# EAGLE schematic bc-module-encoder (EAGLE 7.7.0)
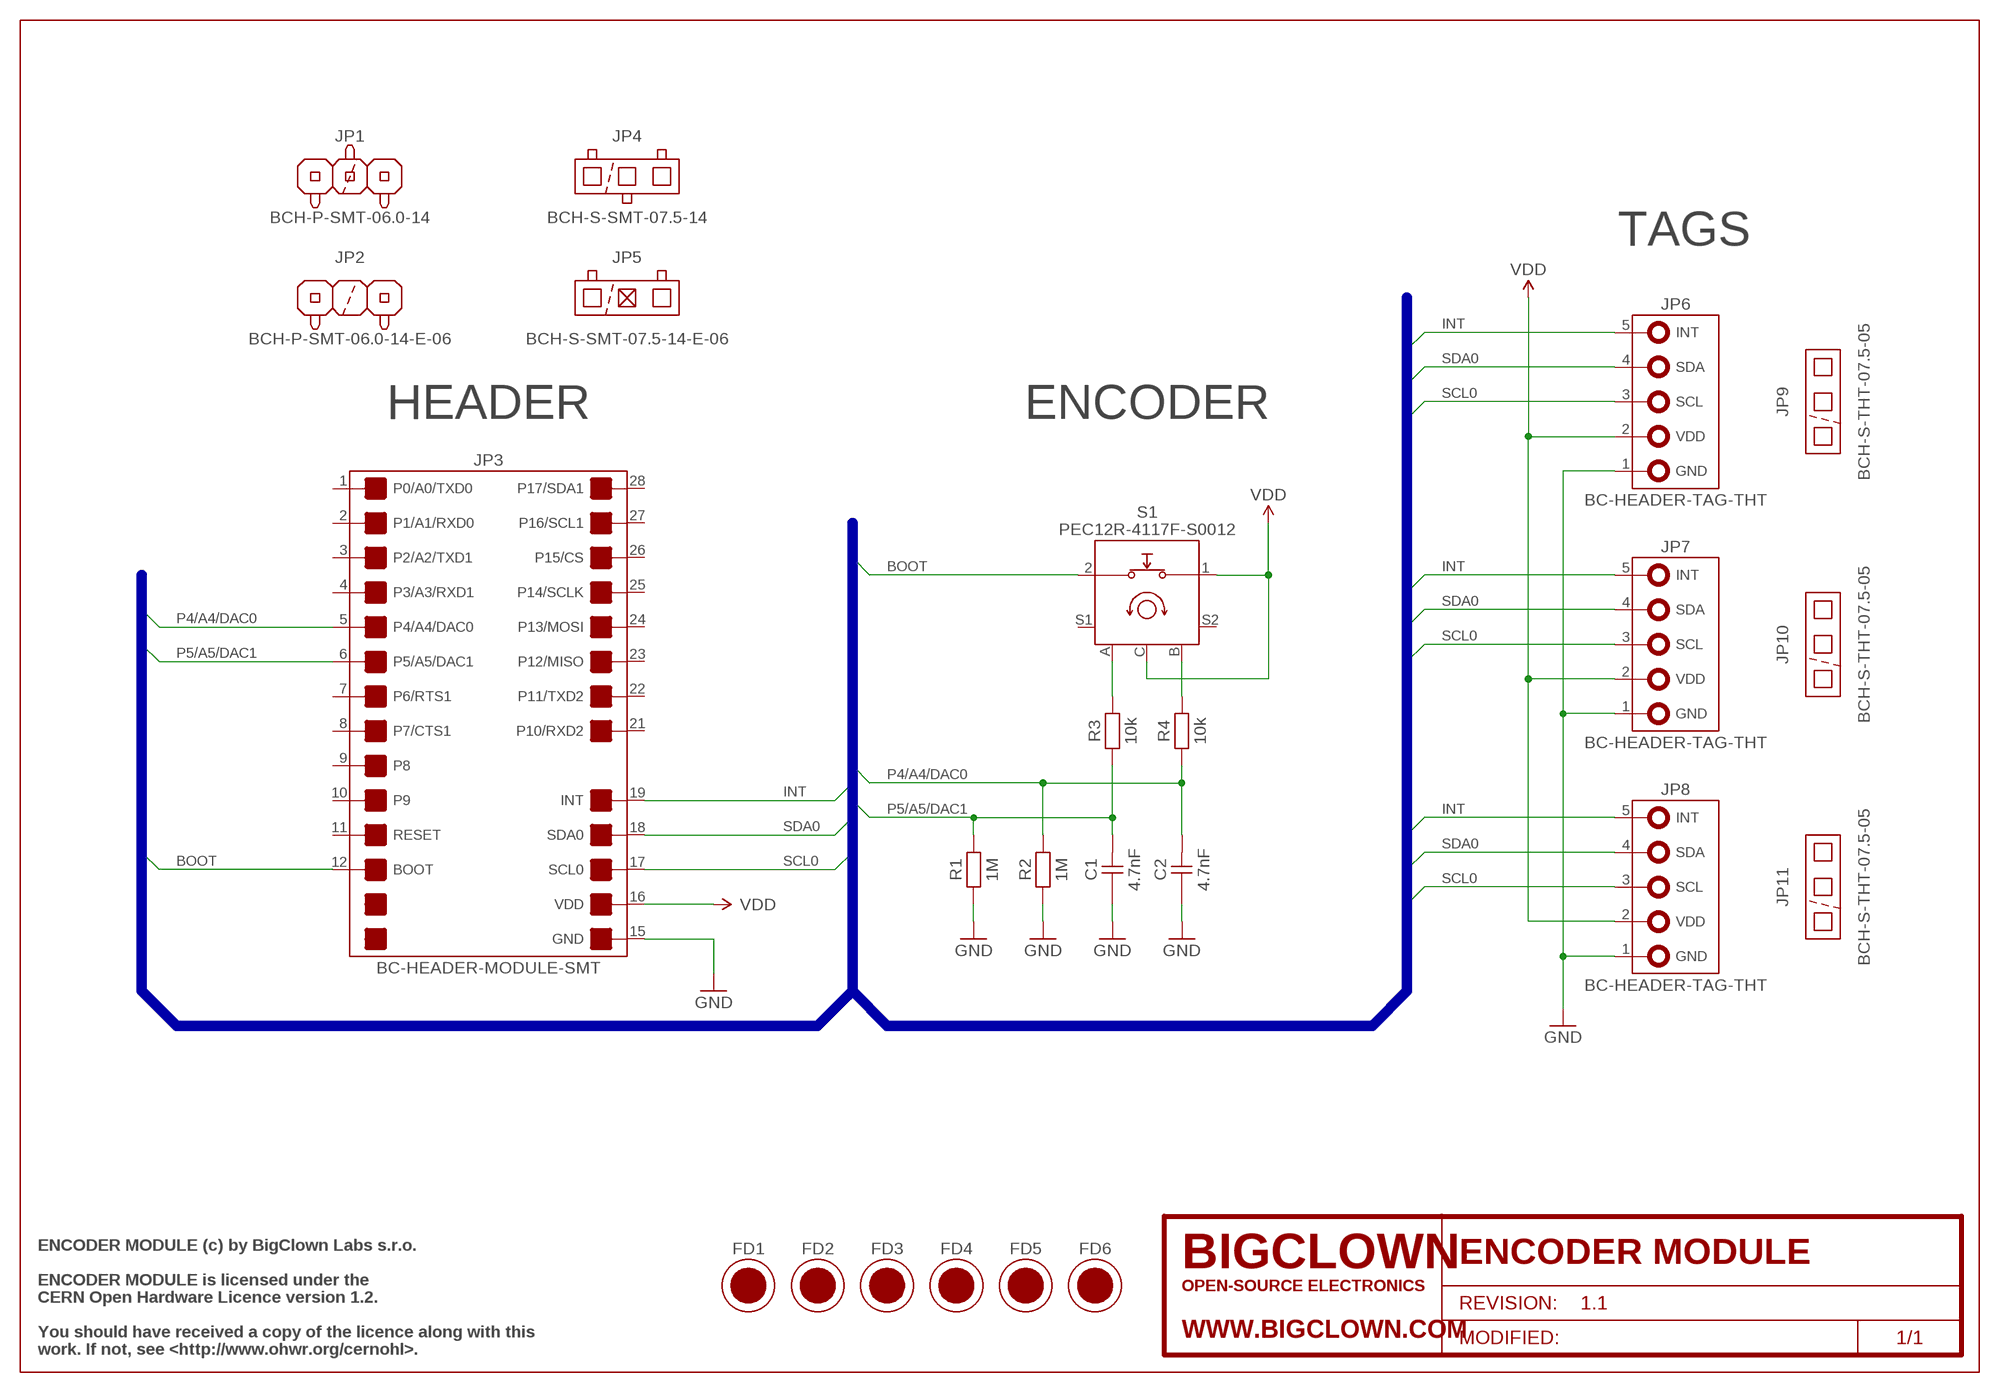
[diagram p0: schematic, sheet 1]

## Parts
C1  4.7nF  C-0805-4.7NF  [CAPACITOR-0805_R]
C2  4.7nF  C-0805-4.7NF  [CAPACITOR-0805_R]
FD1  FIDUCIAL  [FIDUCIAL-1MM]
FD2  FIDUCIAL  [FIDUCIAL-1MM]
FD3  FIDUCIAL  [FIDUCIAL-1MM]
FD4  FIDUCIAL  [FIDUCIAL-1MM]
FD5  FIDUCIAL  [FIDUCIAL-1MM]
FD6  FIDUCIAL  [FIDUCIAL-1MM]
FRAME1  FRAME-SCH/A4L-BRD/A4L  [FRAME-A4L]
JP1  BCH-P-SMT-06.0-14  JP-BCH-P-SMT-06.0-14  [BCH-P-SMT-14]
JP2  BCH-P-SMT-06.0-14-E-06  JP-BCH-P-SMT-06.0-14-E-06  [BCH-P-SMT-14-E-06]
JP3  BC-HEADER-MODULE-SMT  [BC-HEADER-MODULE-SMT]
JP4  BCH-S-SMT-07.5-14  JP-BCH-S-SMT-07.5-14  [BCH-S-SMT-14]
JP5  BCH-S-SMT-07.5-14-E-06  JP-BCH-S-SMT-07.5-14-E-06  [BCH-S-SMT-14-E-06]
JP6  BC-HEADER-TAG-THT  [BC-HEADER-TAG-THT]
JP7  BC-HEADER-TAG-THT  [BC-HEADER-TAG-THT]
JP8  BC-HEADER-TAG-THT  [BC-HEADER-TAG-THT]
JP9  BCH-S-THT-07.5-05  JP-BCH-S-THT-07.5-05  [BCH-S-THT-05]
JP10  BCH-S-THT-07.5-05  JP-BCH-S-THT-07.5-05  [BCH-S-THT-05]
JP11  BCH-S-THT-07.5-05  JP-BCH-S-THT-07.5-05  [BCH-S-THT-05]
R1  1M  R-0805-1M  [RESISTOR-0805_R]
R2  1M  R-0805-1M  [RESISTOR-0805_R]
R3  10k  R-0805-10K  [RESISTOR-0805_R]
R4  10k  R-0805-10K  [RESISTOR-0805_R]
S1  PEC12R-4117F-S0012  S-PEC12R-4117F-S0012  [PEC12R-4117F-S0012_T]

## Nets
BOOT: JP3.12(BOOT) S1.2
ENC_A: R3.2 S1.A
ENC_B: R4.2 S1.B
GND: C1.2 C2.2 JP3.15(GND) JP6.1(GND) JP7.1(GND) JP8.1(GND) R1.1 R2.1
INT: JP3.19(INT) JP6.5(INT) JP7.5(INT) JP8.5(INT)
P4/A4/DAC0: C2.1 JP3.5(P4/A4/DAC0) R2.2 R4.1
P5/A5/DAC1: C1.1 JP3.6(P5/A5/DAC1) R1.2 R3.1
SCL0: JP3.17(SCL0) JP6.3(SCL) JP7.3(SCL) JP8.3(SCL)
SDA0: JP3.18(SDA0) JP6.4(SDA) JP7.4(SDA) JP8.4(SDA)
VDD: JP3.16(VDD) JP6.2(VDD) JP7.2(VDD) JP8.2(VDD) S1.1 S1.C
Unconnected: JP3.1(P0/A0/TXD0) JP3.2(P1/A1/RXD0) JP3.3(P2/A2/TXD1) JP3.4(P3/A3/RXD1) JP3.7(P6/RTS1) JP3.8(P7/CTS1) JP3.9(P8) JP3.10(P9) JP3.11(RESET) JP3.21(P10/RXD2) JP3.22(P11/TXD2) JP3.23(P12/MISO) JP3.24(P13/MOSI) JP3.25(P14/SCLK) JP3.26(P15/CS) JP3.27(P16/SCL1) JP3.28(P17/SDA1) S1.S1 S1.S2

## Buses
INT,SDA0,SCL0,BOOT,P4/A4/DAC0,P5/A5/DAC1

## Notes on the sheet
- TAGS
- HEADER | ENCODER
- ENCODER MODULE (c) by BigClown Labs s.r.o.
- ENCODER MODULE is licensed under the
- CERN Open Hardware Licence version 1.2.
- You should have received a copy of the licence along with this
- work. If not, see <http://www.ohwr.org/cernohl>.

## Library data of the parts
C1 C2 = bc-capacitor:C-0805-4.7NF; BCPN: BC-C-0805-4.7NF
FD1-FD6 = bc-fiducial:FIDUCIAL; BCPN: -
FRAME1 = bc-frame:FRAME-SCH/A4L-BRD/A4L; BCPN: -; PROJECT_NAME: ENCODER MODULE; PROJECT_REVISION: 1.1
JP1 = bc-header:JP-BCH-P-SMT-06.0-14; BCPN: BC-JP-BCH-P-SMT-06.0-14
JP2 = bc-header:JP-BCH-P-SMT-06.0-14-E-06; BCPN: BC-JP-BCH-P-SMT-06.0-14-E-06
JP3 = bc-header:BC-HEADER-MODULE-SMT; BCPN: -
JP4 = bc-header:JP-BCH-S-SMT-07.5-14; BCPN: BC-JP-BCH-S-SMT-07.5-14
JP5 = bc-header:JP-BCH-S-SMT-07.5-14-E-06; BCPN: BC-JP-BCH-S-SMT-07.5-14-E-06
JP6-JP8 = bc-header:BC-HEADER-TAG-THT; BCPN: -
JP9-JP11 = bc-header:JP-BCH-S-THT-07.5-05; BCPN: BC-JP-BCH-S-THT-07.5-05
R1 R2 = bc-resistor:R-0805-1M; BCPN: BC-R-0805-1M
R3 R4 = bc-resistor:R-0805-10K; BCPN: BC-R-0805-10K
S1 = bc-switch:S-PEC12R-4117F-S0012; BCPN: BC-S-PEC12R-4117F-S0012